# Altium schematic sheet 数显表原理图20250707-2.SchDoc
size A2
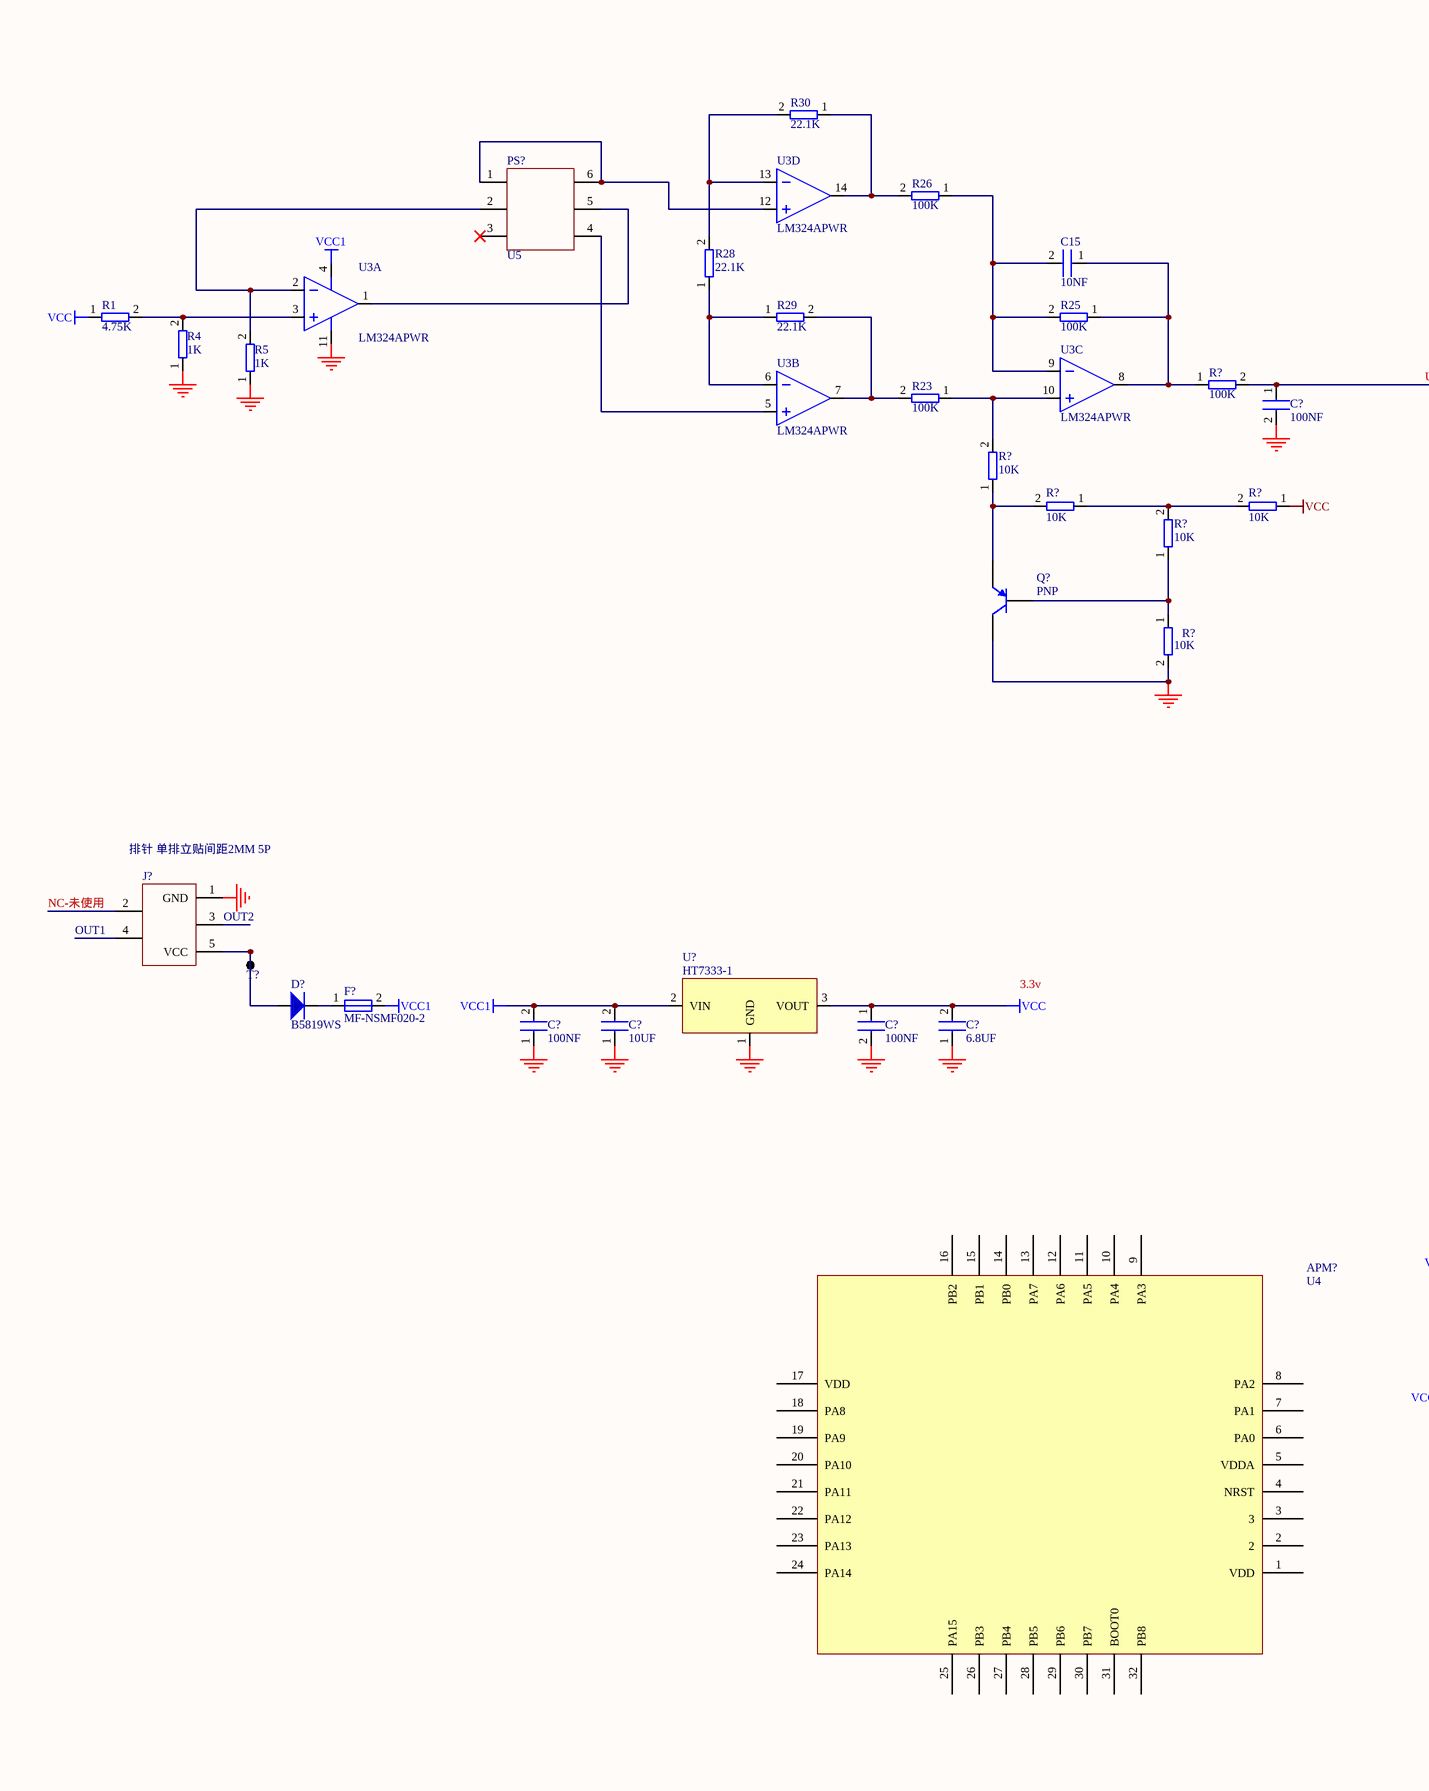
[diagram p0: 数显表原理图20250707-2.SchDoc, left]
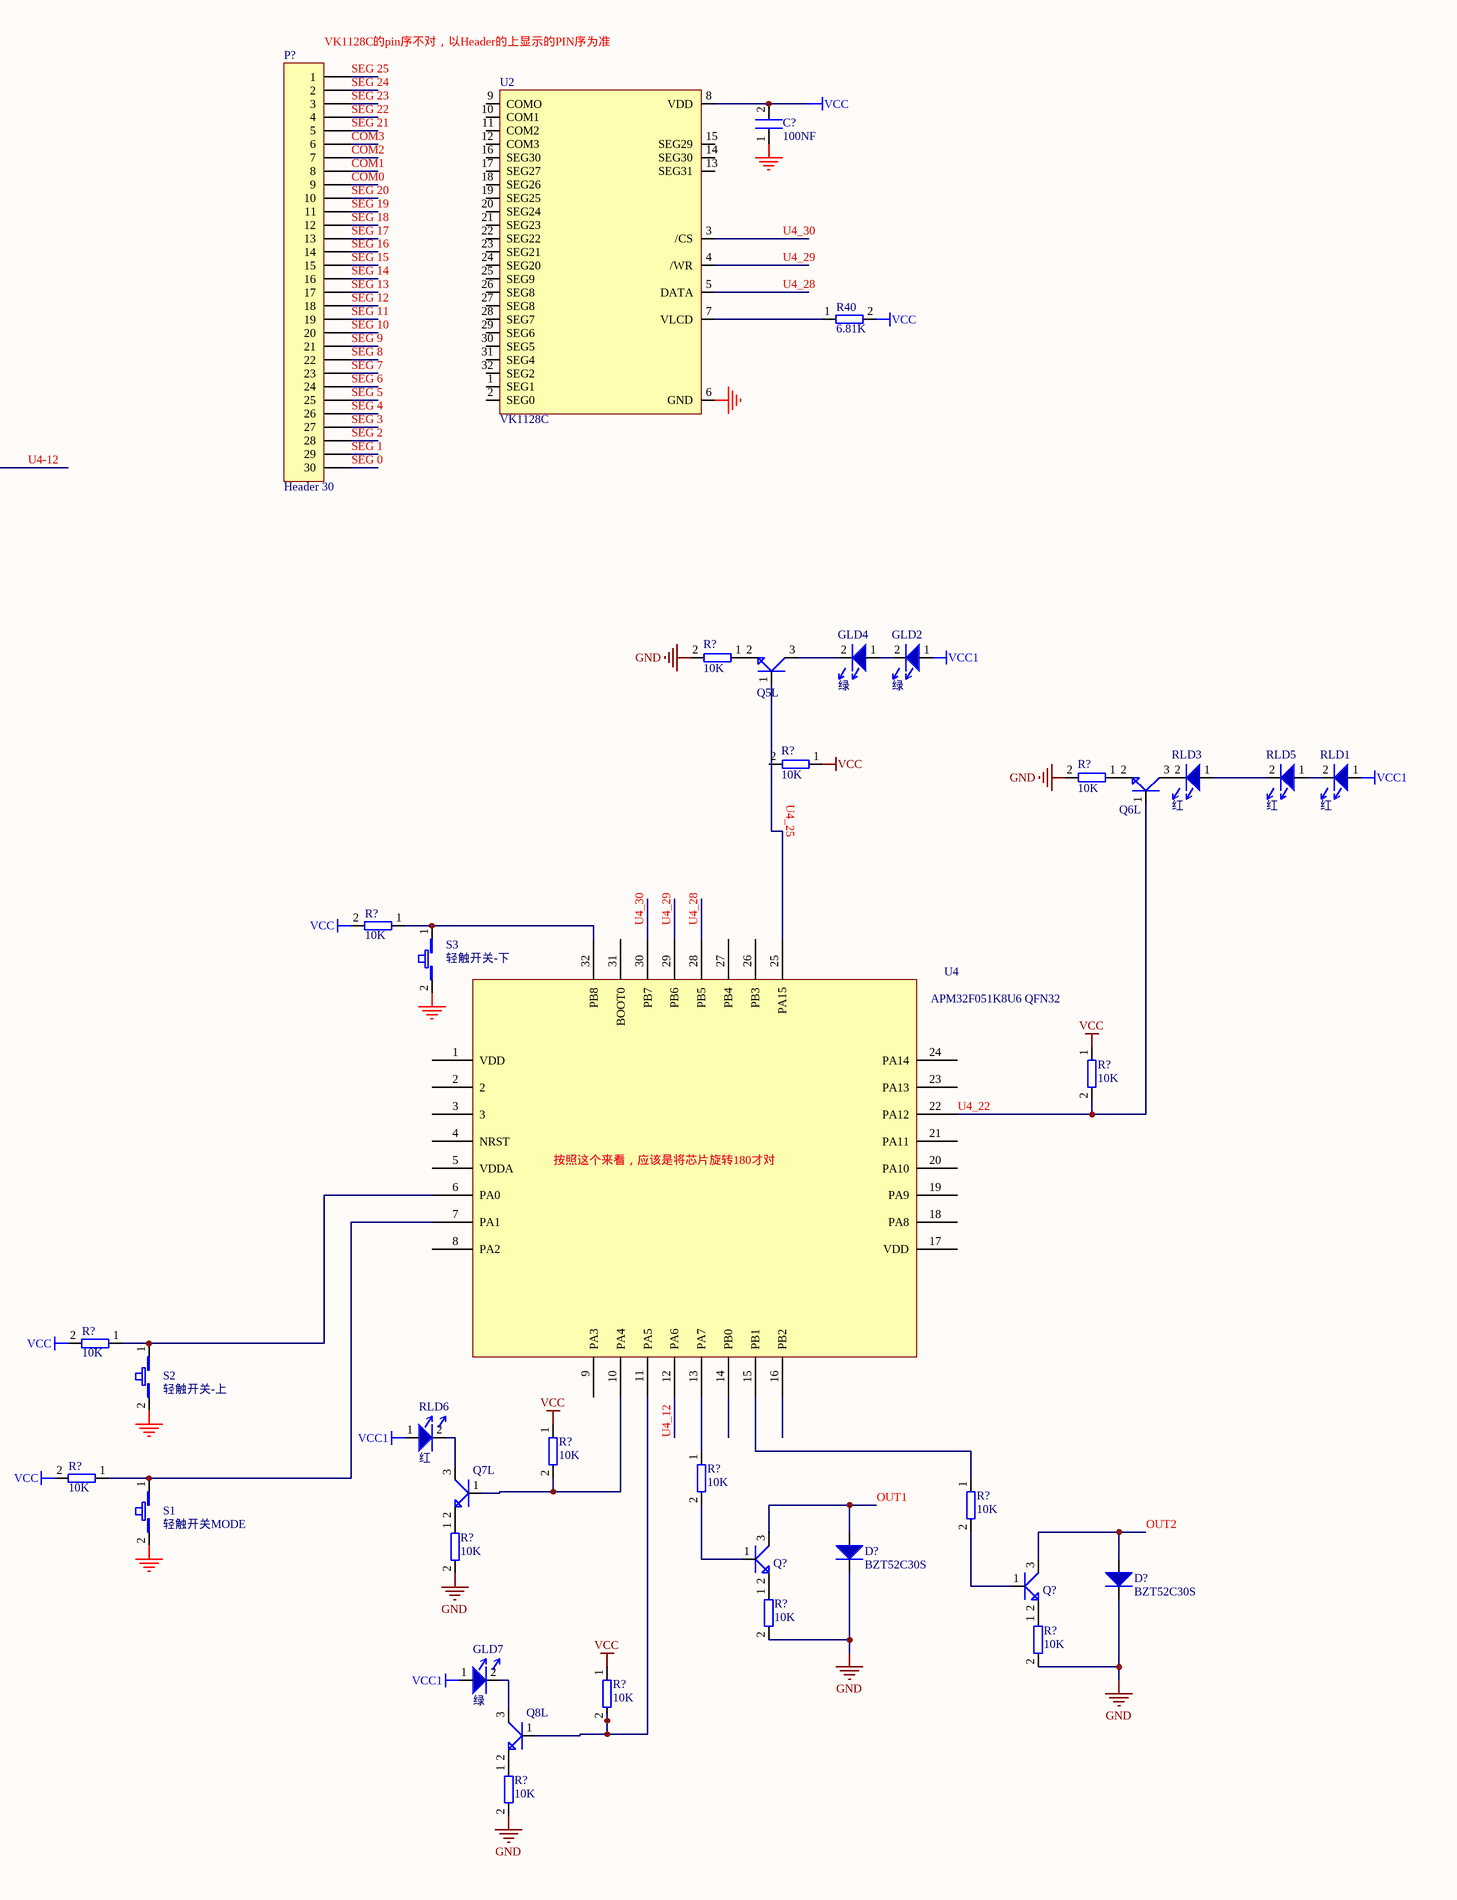
[diagram p1: 数显表原理图20250707-2.SchDoc, right]

## Parts
(Parts that share a designator on the sheet are numbered #1, #2 ... from top to bottom, then left to right.)
APM32F051K8U6_QFN32  U4
APM?  U4
C15  10NF
C?#1  100NF
C?#2  100NF
C?#3  100NF
C?#4  100NF
C?#5  10UF
C?#6  6.8UF
D?#1  B5819WS
D?#2  BZT52C30S
D?#3  BZT52C30S
F?  MF-NSMF020-2
GLD2  绿
GLD4  绿
GLD7  绿
J?  排针 单排立贴间距2MM 5P
P?  Header 30  [HDR1X30]
PS?  U5
Q5L  2SC4617TLR  (value not drawn)
Q6L  2SC4617TLR  (value not drawn)
Q7L  2SC4617TLR  (value not drawn)
Q8L  2SC4617TLR  (value not drawn)
Q?#1  PNP  [SOT-23B_L]
Q?#2  2SC4617TLR  (value not drawn)
Q?#3  2SC4617TLR  (value not drawn)
R1  4.75K
R4  1K
R5  1K
R23  100K
R25  100K
R26  100K
R28  22.1K
R29  22.1K
R30  22.1K
R40  6.81K
R?#1  100K
R?#2  10K
R?#3  10K
R?#4  10K
R?#5  10K
R?#6  10K
R?#7  10K
R?#8  10K
R?#9  10K
R?#10  10K
R?#11  10K
R?#12  10K
R?#13  10K
R?#14  10K
R?#15  10K
R?#16  10K
R?#17  10K
R?#18  10K
R?#19  10K
R?#20  10K
R?#21  10K
RLD1  红
RLD3  红
RLD5  红
RLD6  红
S1  轻触开关MODE
S2  轻触开关-上
S3  轻触开关-下
T?  (no value)
U2  VK1128C
U3  LM324APWR  (parts A,B,C,D of 4)
U?  HT7333-1

## Nets
GND: C?#1.1 C?#2.2 C?#3.2 C?#4.1 C?#5.1 C?#6.1 D?#2.2 D?#3.2 J?.1(GND) Q?#1.1(C) R4.1 R5.1 R?#6.2 R?#7.2 R?#9.2 R?#17.2 R?#18.2 R?#19.2 R?#21.2 S1.2(A2) S2.2(A2) S3.2(A2) U2.6(GND) U3.11(GND) U?.1(GND)
VCC: C?#1.2 C?#3.1 C?#6.2 R1.1 R40.2 R?#4.1 R?#8.1 R?#10.2 R?#11.1 R?#12.2 R?#13.1 R?#15.2 R?#20.1 U2.8(VDD) U?.3(VOUT)
VCC1: C?#4.2 C?#5.2 F?.2 GLD2.1 GLD7.1 RLD1.1 RLD6.1 U3.4(VCC) U?.2(VIN)
COM0: P?.9
COM1: P?.8
COM2: P?.7
COM3: P?.6
NC-未使用: J?.2
SEG 0: P?.30
SEG 1: P?.29
SEG 2: P?.28
SEG 3: P?.27
SEG 4: P?.26
SEG 5: P?.25
SEG 6: P?.24
SEG 7: P?.23
SEG 8: P?.22
SEG 9: P?.21
SEG 10: P?.20
SEG 11: P?.19
SEG 12: P?.18
SEG 13: P?.17
SEG 14: P?.16
SEG 15: P?.15
SEG 16: P?.14
SEG 17: P?.13
SEG 18: P?.12
SEG 19: P?.11
SEG 20: P?.10
SEG 21: P?.5
SEG 22: P?.4
SEG 23: P?.3
SEG 24: P?.2
SEG 25: P?.1
U4-12: C?#2.1 R?#1.2
U4_28: U2.5(DATA)
U4_29: U2.4(/WR)
U4_30: U2.3(/CS)
NetAPM32F051K8U6_QFN32_6: APM32F051K8U6_QFN32.6(PA0) R?#12.1 S2.1(A1)
NetAPM32F051K8U6_QFN32_7: APM32F051K8U6_QFN32.7(PA1) R?#15.1 S1.1(A1)
NetAPM32F051K8U6_QFN32_10: APM32F051K8U6_QFN32.10(PA4) Q7L.1(B) R?#13.2
NetAPM32F051K8U6_QFN32_11: APM32F051K8U6_QFN32.11(PA5) Q8L.1(B) R?#20.2
NetAPM32F051K8U6_QFN32_13: APM32F051K8U6_QFN32.13(PA7) R?#14.1
NetAPM32F051K8U6_QFN32_15: APM32F051K8U6_QFN32.15(PB1) R?#16.1
NetAPM32F051K8U6_QFN32_22: APM32F051K8U6_QFN32.22(PA12) Q6L.1(B) R?#11.2
NetAPM32F051K8U6_QFN32_25: APM32F051K8U6_QFN32.25(PA15) Q5L.1(B)
NetAPM32F051K8U6_QFN32_32: APM32F051K8U6_QFN32.32(PB8) R?#10.1 S3.1(A1)
NetC15_1: C15.1 R25.1 R?#1.1 U3.8(OUT)
NetC15_2: C15.2 R25.2 R26.1 U3.9(-)
NetD?#1_1: D?#1.1 J?.5(VCC) T?.1
NetD?#1_2: D?#1.2 F?.1
NetD?#2_1: D?#2.1 Q?#2.3(C)
NetD?#3_1: D?#3.1 Q?#3.3(C)
NetGLD2_2: GLD2.2 GLD4.1
NetGLD4_2: GLD4.2 Q5L.3(C)
NetGLD7_2: GLD7.2 Q8L.3(C)
NetPS?_1: PS?.1 PS?.6 U3.12(+)
NetPS?_2: PS?.2 R5.2 U3.2(-)
NetPS?_4: PS?.4 U3.5(+)
NetPS?_5: PS?.5 U3.1(OUT)
NetQ5L_2: Q5L.2(E) R?#6.1
NetQ6L_2: Q6L.2(E) R?#9.1
NetQ6L_3: Q6L.3(C) RLD3.2
NetQ7L_2: Q7L.2(E) R?#17.1
NetQ7L_3: Q7L.3(C) RLD6.2
NetQ8L_2: Q8L.2(E) R?#21.1
NetQ?#1_2: Q?#1.2(B) R?#5.1 R?#7.1
NetQ?#1_3: Q?#1.3(E) R?#2.1 R?#3.2
NetQ?#2_1: Q?#2.1(B) R?#14.2
NetQ?#2_2: Q?#2.2(E) R?#18.1
NetQ?#3_1: Q?#3.1(B) R?#16.2
NetQ?#3_2: Q?#3.2(E) R?#19.1
NetR1_2: R1.2 R4.2 U3.3(+)
NetR23_1: R23.1 R?#2.2 U3.10(+)
NetR23_2: R23.2 R29.2 U3.7(OUT)
NetR26_2: R26.2 R30.1 U3.14(OUT)
NetR28_1: R28.1 R29.1 U3.6(-)
NetR28_2: R28.2 R30.2 U3.13(-)
NetR40_1: R40.1 U2.7(VLCD)
NetR?#3_1: R?#3.1 R?#4.2 R?#5.2
NetRLD1_2: RLD1.2 RLD5.1
NetRLD3_1: RLD3.1 RLD5.2

Not connected (* = marked no-connect by the designer): APM32F051K8U6_QFN32 1(VDD) 2 3 4(NRST) 5(VDDA) 8(PA2) 9(PA3) 12(PA6) 14(PB0) 16(PB2) 17(VDD) 18(PA8) 19(PA9) 20(PA10) 21(PA11) 23(PA13) 24(PA14) 26(PB3) 27(PB4) 28(PB5) 29(PB6) 30(PB7) 31(BOOT0); APM? 1(VDD) 2 3 4(NRST) 5(VDDA) 6(PA0) 7(PA1) 8(PA2) 9(PA3) 10(PA4) 11(PA5) 12(PA6) 13(PA7) 14(PB0) 15(PB1) 16(PB2) 17(VDD) 18(PA8) 19(PA9) 20(PA10) 21(PA11) 22(PA12) 23(PA13) 24(PA14) 25(PA15) 26(PB3) 27(PB4) 28(PB5) 29(PB6) 30(PB7) 31(BOOT0) 32(PB8); J? 3 4; PS? 3*; R?#8 2; U2 1(SEG1) 2(SEG0) 9(COMO) 10(COM1) 11(COM2) 12(COM3) 13(SEG31) 14(SEG30) 15(SEG29) 16(SEG30) 17(SEG27) 18(SEG26) 19(SEG25) 20(SEG24) 21(SEG23) 22(SEG22) 23(SEG21) 24(SEG20) 25(SEG9) 26(SEG8) 27(SEG8) 28(SEG7) 29(SEG6) 30(SEG5) 31(SEG4) 32(SEG2)

## Notes on the sheet
- (near P?) VK1128C的pin序不对，以Header的上显示的PIN序为准
- (near R?#8) U4_25
- U4_30
- U4_29
- U4_28
- (near J?) OUT1
- OUT2
- (near APM32F051K8U6_QFN32) 按照这个来看，应该是将芯片旋转180才对
- (near APM32F051K8U6_QFN32) U4_22
- U4_12
- OUT1
- (near D?#3) OUT2
- Labels drawn without touching a wire or pin: 3.3v

## Library data of the parts
APM32F051K8U6_QFN32 APM? = Component_1
C15 C?#1-C?#6 = CAP
D?#1-D?#3 = D
F? = FUSE
GLD2 GLD4 GLD7 RLD1 RLD3 RLD5 RLD6 = LED
J? = J1
P? = Header 30: Header, 30-Pin; LatestRevisionDate: 17-Jul-2002; LatestRevisionNote: Re-released for DXP Platform.; Publisher: Altium Limited
PS? = PS1
Q5L Q6L Q7L Q8L Q?#2 Q?#3 = 2SC4617
Q?#1 = PNP: PNP Bipolar Transistor; Published: 8-Jun-2000; LatestRevisionDate: 29-May-2009; LatestRevisionNote: IPC-7351 Footprint Added.; PackageVersion: Aug-1999; PackageReference: SOT-23B; Publisher: Altium Limited; PackageDescription: 3-Pin SOT-23 Package 0.95 mm Pitch, 2.4 mm Lead Span
R1 R4 R5 R23 R25 R26 R28-R30 R40 R?#1-R?#21 = RES
S1-S3 = SW
T? = TP
U2 = VK1088B
U3 = LM324APW
U? = HT7550-1